# EasyEDA schematic pin-led.json
TITLE: pin-led Schematic; REV: 1.0; Date: 2021-02-09; Sheet: 1/1; Drawn By: Jan Pieper; Company: Your Company
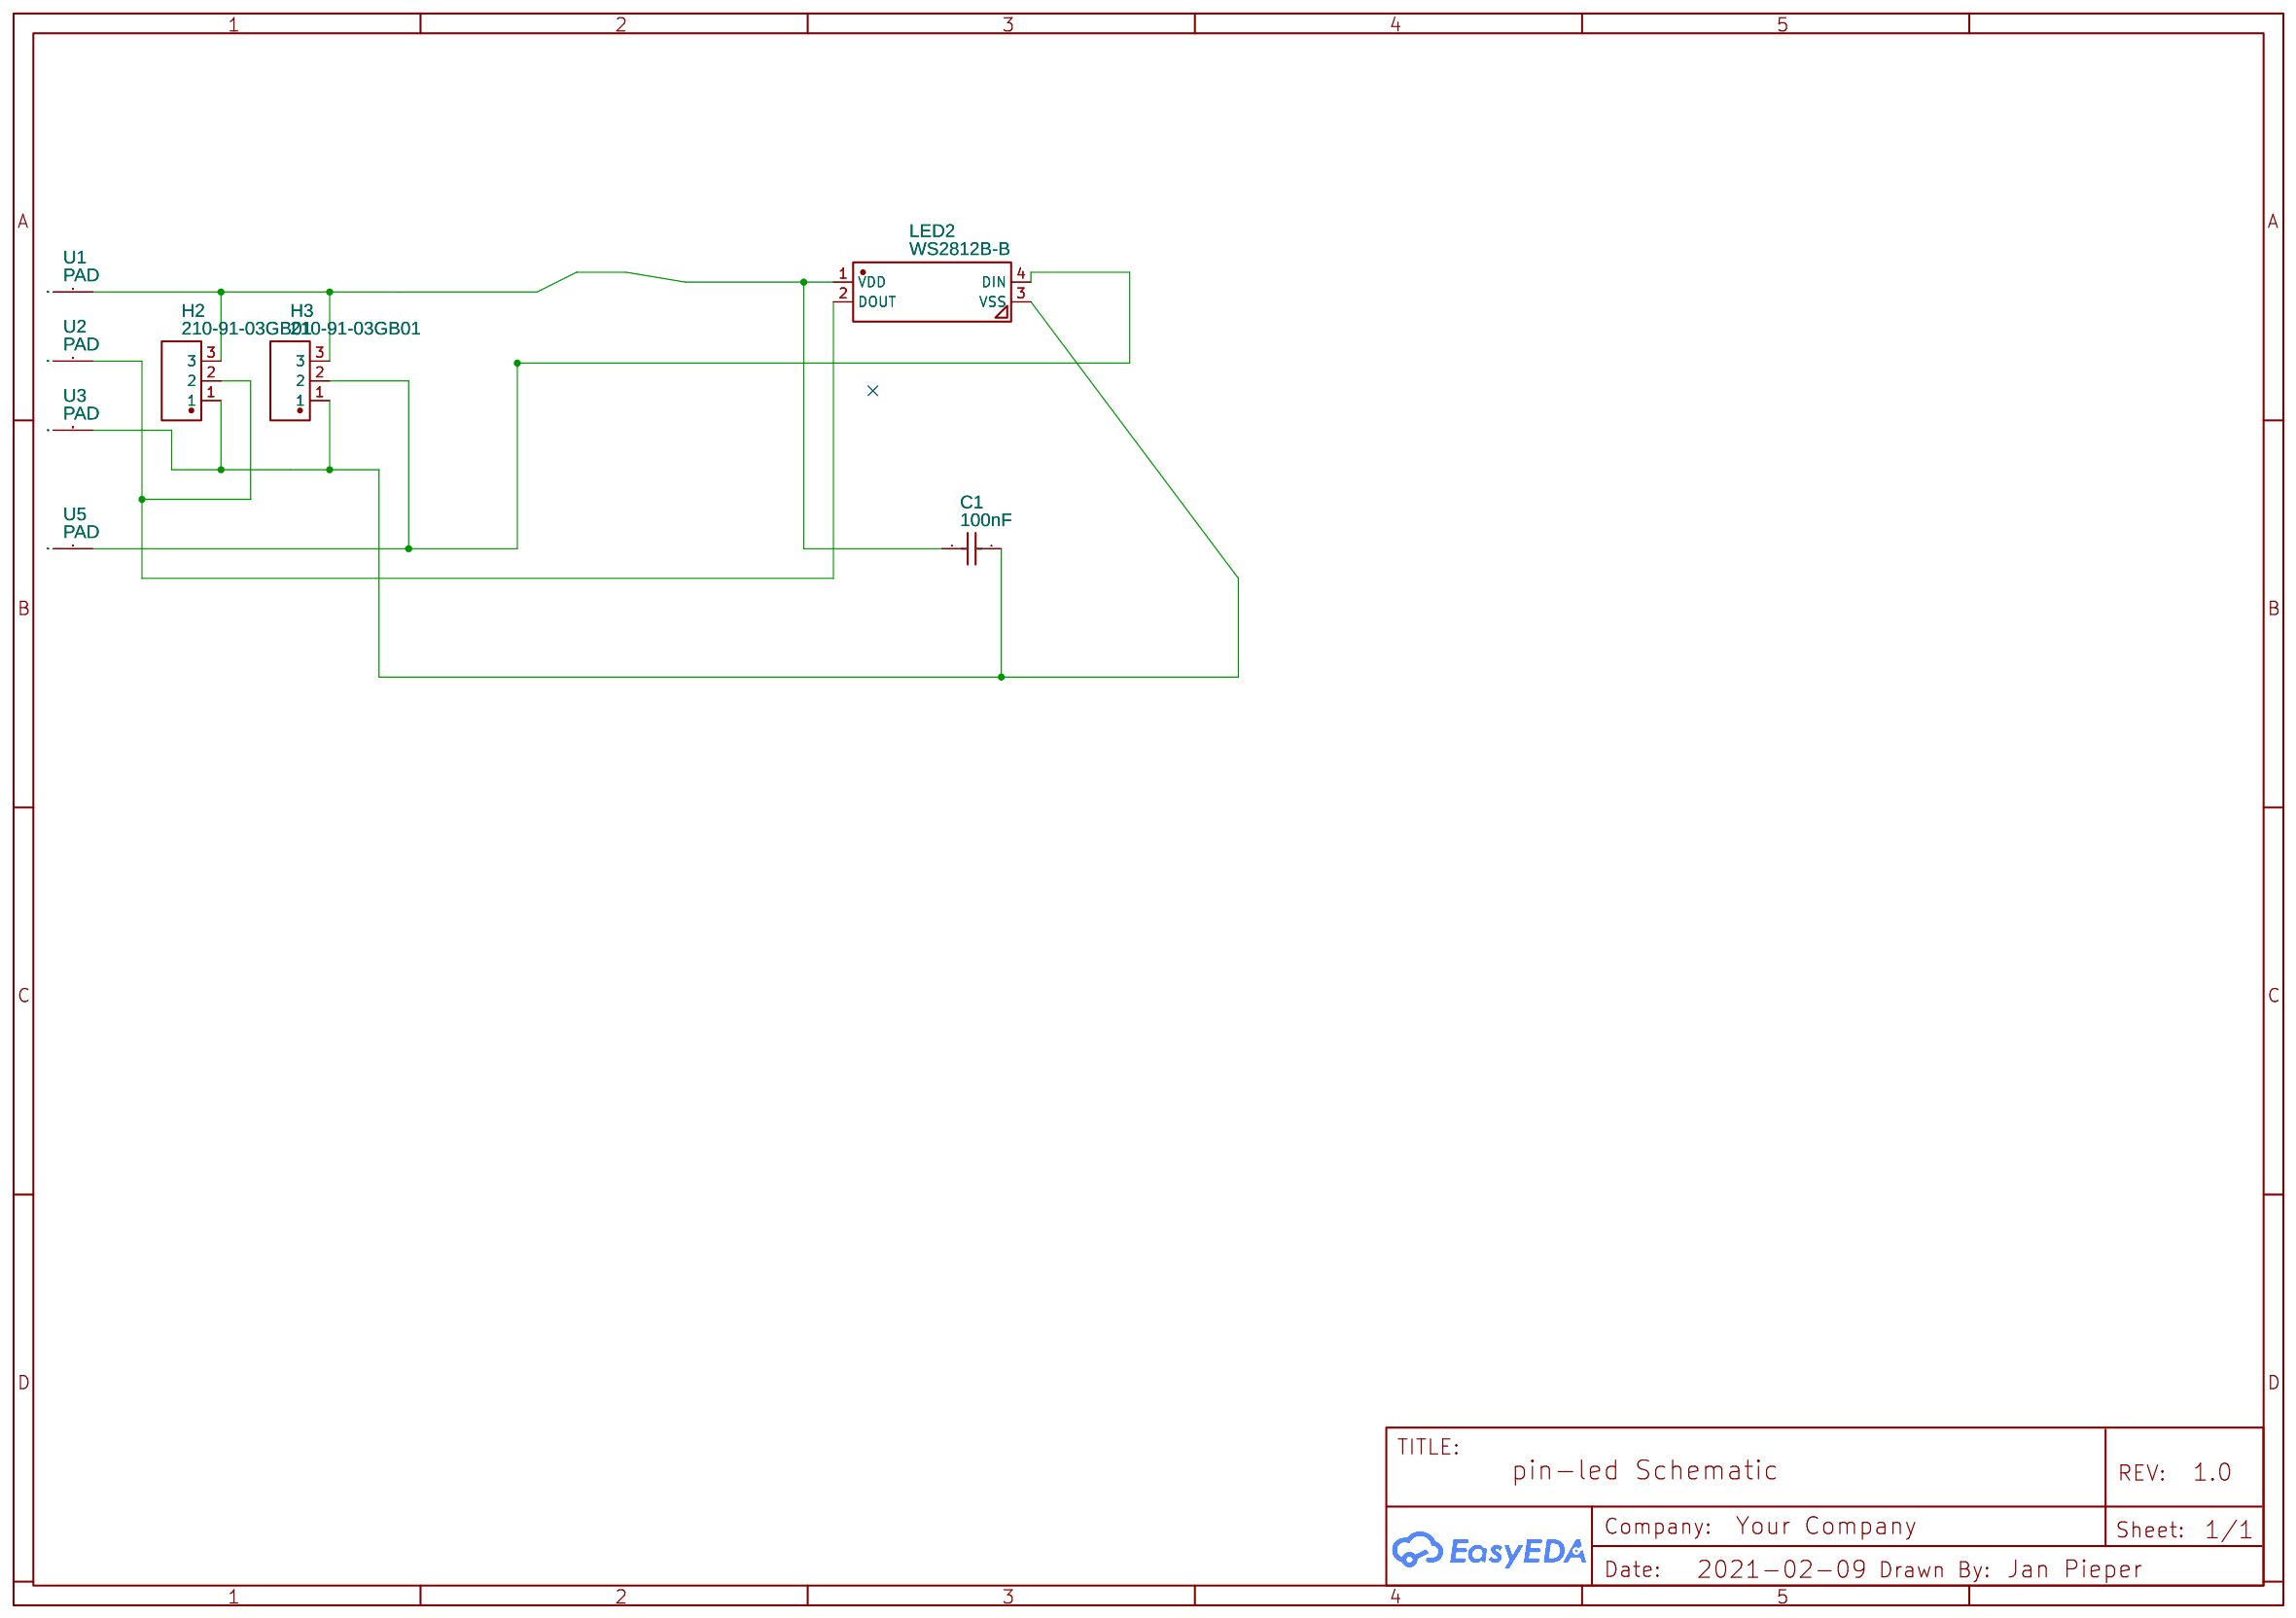
[diagram p0: schematic sheet]

## Parts
C1  100nF  [C0402]
H2  210-91-03GB01  [HDR-TH_3P-P2.54-V_A2541HWV-3P]
H3  210-91-03GB01  [HDR-TH_3P-P2.54-V_A2541HWV-3P]
LED2  WS2812B-B  [LED-SMD_4P-L5.0-W5.0-TL_WS2812B-B]
U1  PAD  [PAD-60-31-RECT]
U2  PAD  [PAD-60-31-RECT]
U3  PAD  [PAD-60-31-RECT]
U5  PAD  [PAD-60-31-RECT]

## Library data of the parts
C1 = CL05B104KO5NNNC: Supplier: LCSC; Manufacturer: SAMSUNG; Supplier Part: C1525; SMT Type: Basic; JLCPCB SMD: Yes; LCSC Assembly: Yes
H2 H3 = 210-91-03GB01: Supplier: LCSC; Supplier Part: C390679; Manufacturer: PINREX; Contributor: LCSC; LCSC Assembly: Yes; SMT Type: Extend
LED2 = WS2812B-B: Supplier: LCSC; Manufacturer: Worldsemi; Contributor: LCSC; Supplier Part: C114586; SMT Type: Extend; JLCPCB SMD: Yes
U1-U3 U5 = PAD: Contributor: Pinoccio

## Nets
Net-(C1-1): C1.1 H2.3 H3.3 LED2.1(VDD) U1.P$1
Net-(C1-2): C1.2 H2.1 H3.1 LED2.3(VSS) U3.P$1
Net-(H2-2): H2.2 LED2.2(DOUT) U2.P$1
Net-(H3-2): H3.2 LED2.4(DIN) U5.P$1
